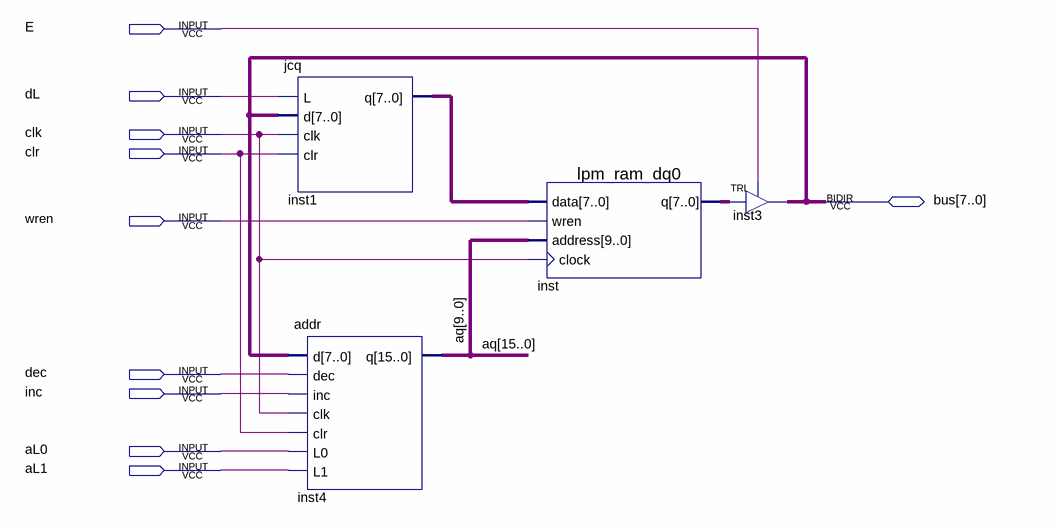
[diagram p0: schematic sheet]
// Quartus schematic stack.bdf as structural Verilog: 4 symbols, 10 pins
module stack (
  input  E,
  input  dL,
  input  clk,
  input  clr,
  input  wren,
  input  dec,
  input  inc,
  input  aL0,
  input  aL1,
  inout  [7:0] bus
);

  wire [7:0] inst1_q, inst_q;
  wire [15:0] aq;

  jcq inst1 (.L(dL), .d(bus), .clk(clk), .clr(clr), .q(inst1_q));
  addr inst4 (.d(bus), .dec(dec), .inc(inc), .clk(clk), .clr(clr), .L0(aL0), .L1(aL1), .q(aq));
  lpm_ram_dq0 inst (.data(inst1_q), .wren(wren), .address(aq[9:0]), .clock(clk), .q(inst_q));
  TRI inst3[7:0] (.IN(inst_q), .OE(E), .OUT(bus));
endmodule
